# EAGLE design heater-board (EAGLE 5.11)
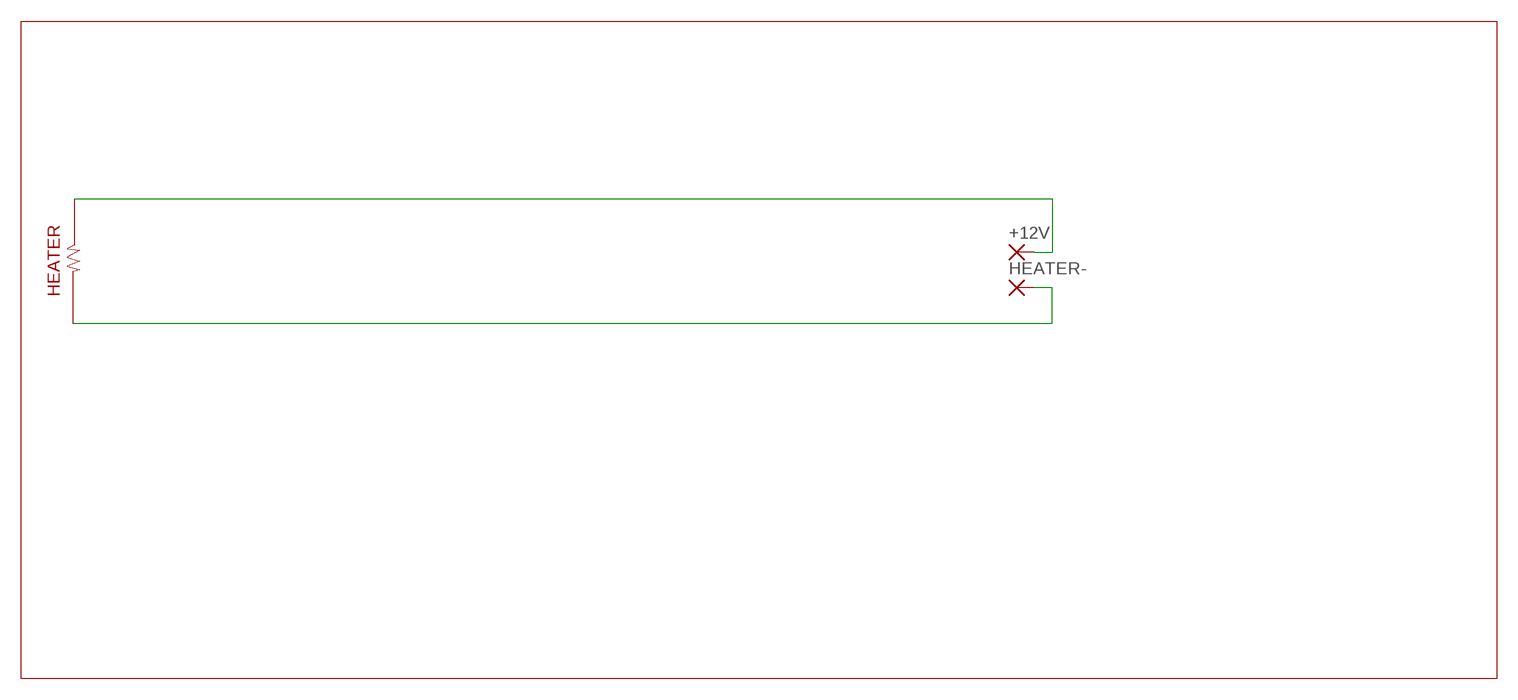
[diagram p0: schematic, sheet 1]

## Parts
+12V  WIREPADSMD5-1,8  [5-1,8]
HEATER-  WIREPADSMD5-1,8  [5-1,8]

## Nets
N$1: HEATER-.1(P)
N$37: +12V.1(P)

## Notes on the sheet
- HEATER

## Library data of the parts
+12V HEATER- = wirepad:WIREPAD: Wire PAD connect wire on PCB

## Board
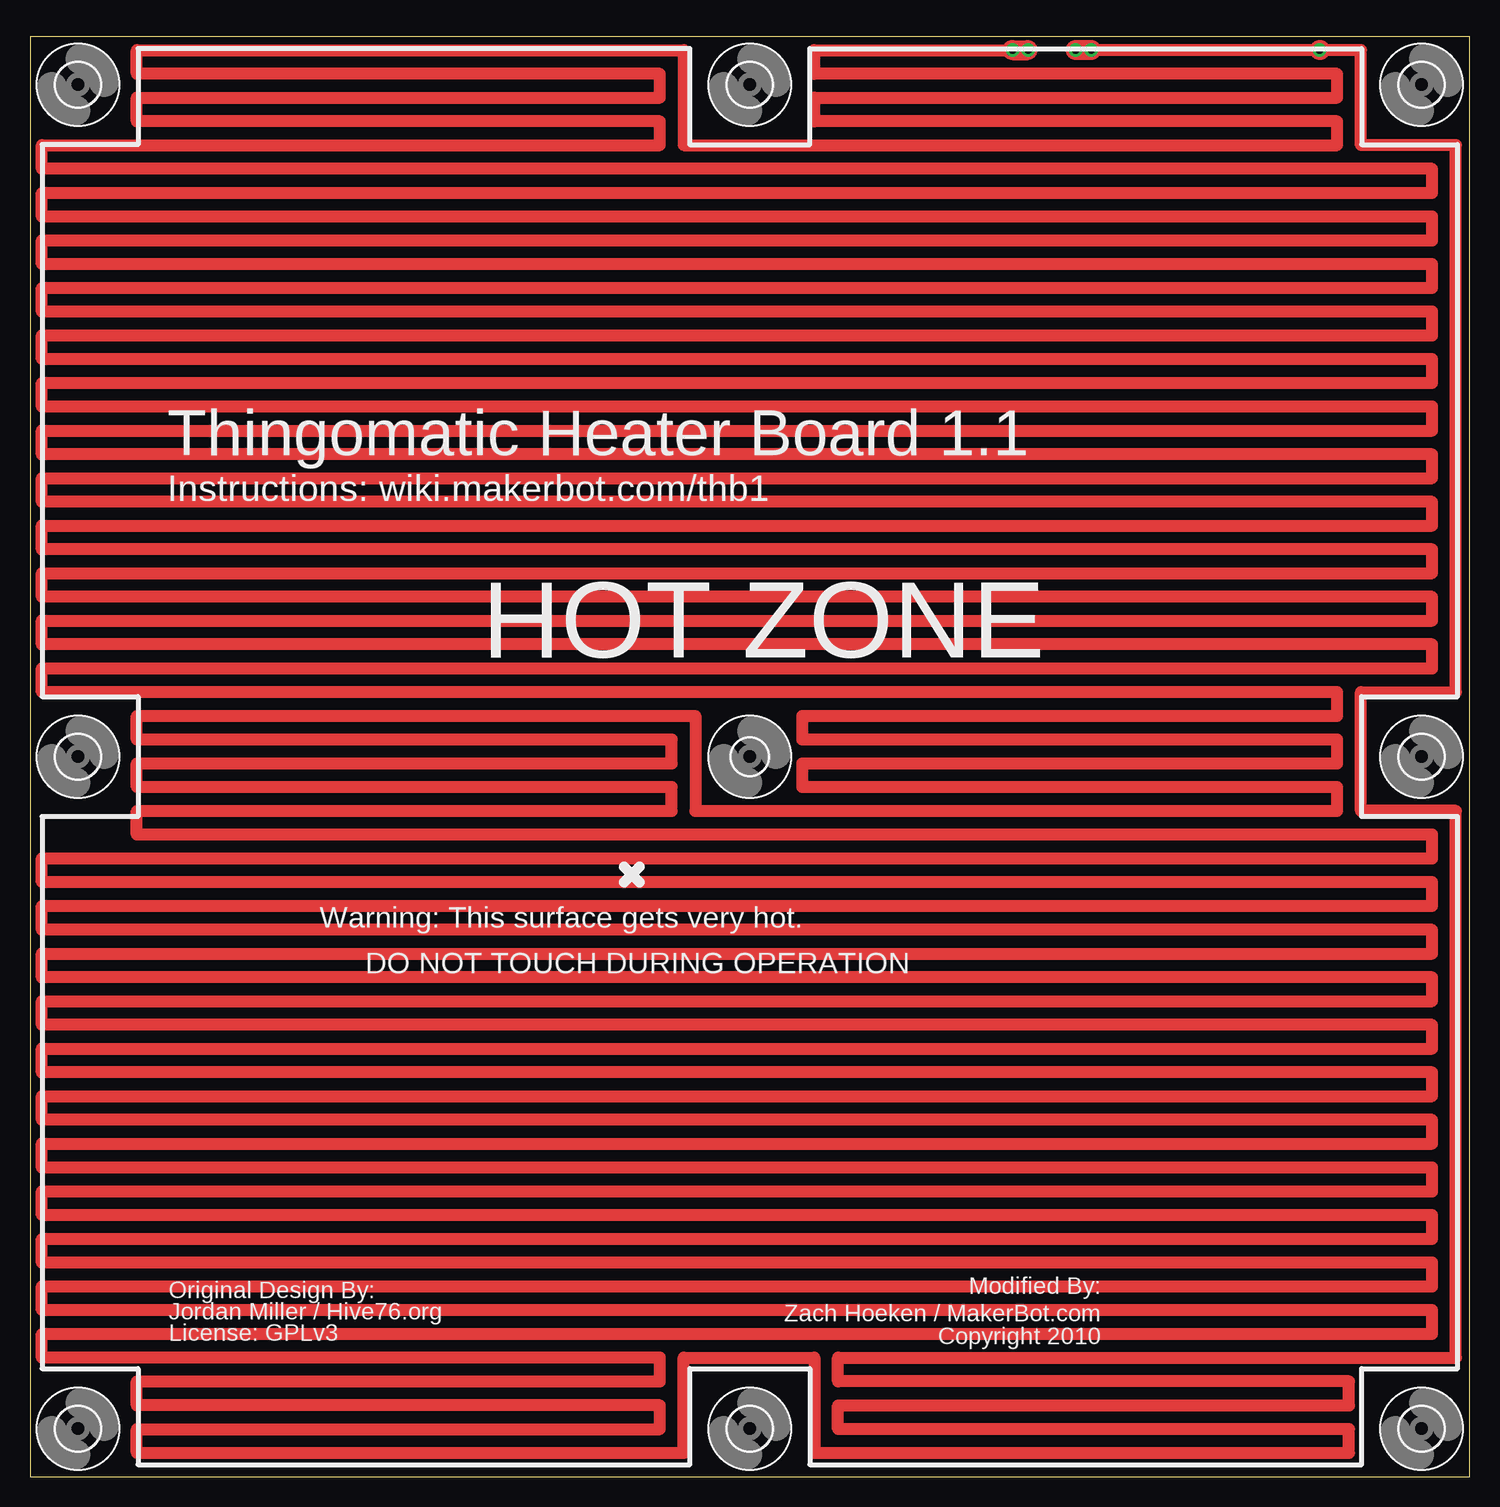
[diagram p1: board, top side]
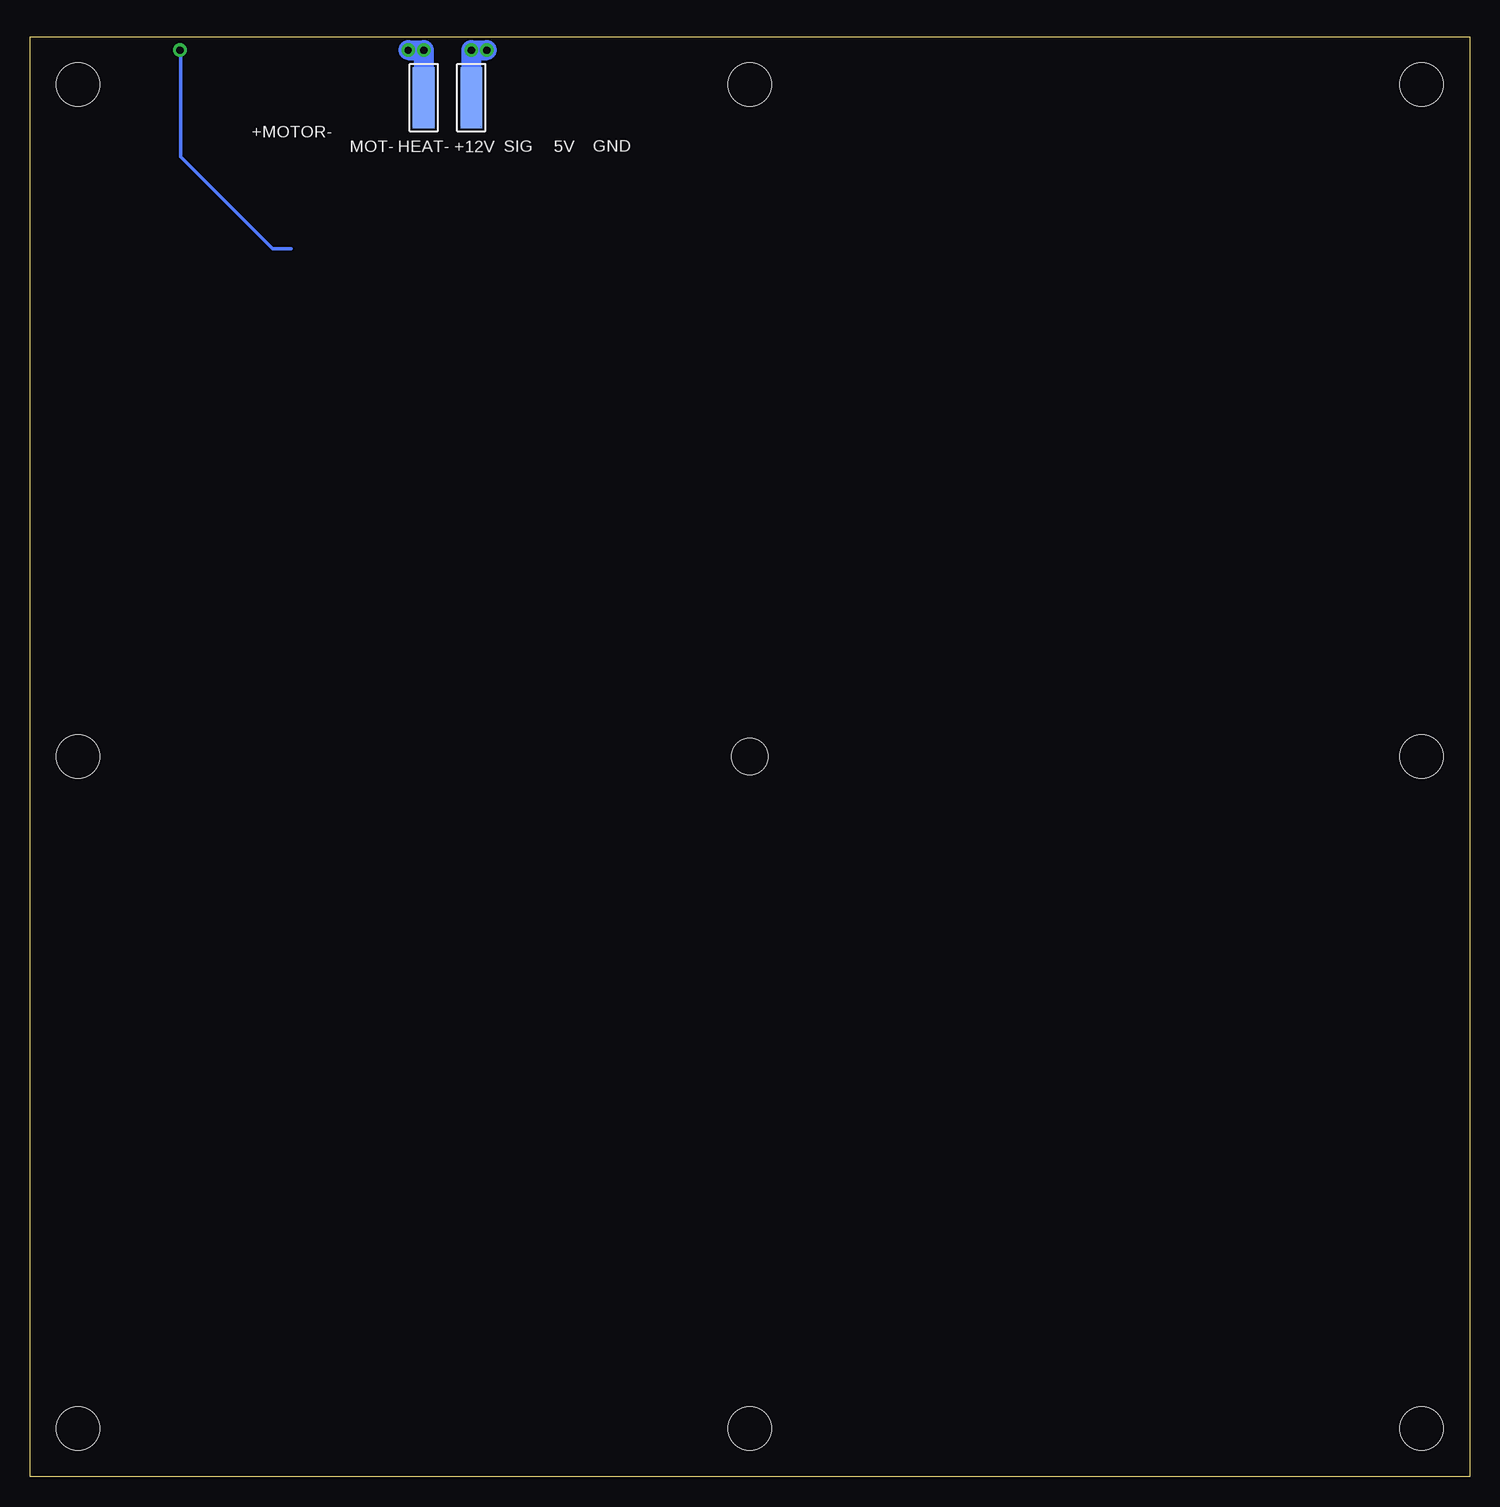
[diagram p2: board, bottom side, seen from below]

Size 120 x 120 mm. Coordinates in mm from the lower left corner, seen from the top.
Outline: 0,0 120,0 120,120 0,120 0,0
Copper layers (1*16): Top 0.035mm / dielectric 1.5mm / Bottom 0.035mm
Design rules "SparkFun *": minimum track width 10mil, minimum drill 20mil, track to track 10mil, track to pad 10mil, pad to pad 10mil, via to via 10mil, smd to smd 10mil, copper to edge 10mil, drill to drill 8mil, minimum pad ring 12mil, minimum via ring 10mil, stop-mask expansion 4mil, vias tented up to drill 25mil, thermal gap 10mil

### Footprints (pad centres in the part's own frame; a part is rotated, then mirrored left to right if it is on the bottom)
5-1,8 = smd 1.829 x 5.08: 1 0,0
3,0 = hole 3: 0,0
3,6 = hole 3.6: 0,0

### Placement (x,y rotation side)
+12V  83.21,114.91 180 bottom
HEATER-  87.17,114.91 180 bottom
U$1  [3,0]  60,60 0 top
U$2  [3,6]  4,4 0 top
U$3  [3,6]  4,60 0 top
U$4  [3,6]  4,116 0 top
U$5  [3,6]  116,116 0 top
U$6  [3,6]  116,60 0 top
U$7  [3,6]  116,4 0 top
U$8  [3,6]  60,4 0 top
U$9  [3,6]  60,116 0 top

### Tracks (layer width: path | path; a pad name or v marks a point on that pad's centre or on a via)
N$1  (via drill 0.6)
  Top 0.991: 107.56,118.87 110.95,118.87 110.95,110.95 118.87,110.95 118.87,65.38 110.95,65.38 110.95,55.47 118.87,55.47 118.87,9.91 67.36,9.91 67.36,7.92 109.96,7.92 109.96,5.94 67.36,5.94 67.36,3.96 109.96,3.96 109.96,1.98 65.38,1.98 65.38,9.91 54.48,9.91 54.48,1.98 8.91,1.98 8.91,3.96 52.5,3.96 52.5,5.94 8.91,5.94 8.91,7.92 52.5,7.92 52.5,9.91 0.99,9.91 0.99,11.89 116.89,11.89 116.89,13.87 0.99,13.87 0.99,15.85 116.89,15.85 116.89,17.83 0.99,17.83 0.99,19.81 116.89,19.81 116.89,21.79 0.99,21.79 0.99,23.77 116.89,23.77 116.89,25.76 0.99,25.76 0.99,27.74 116.89,27.74 116.89,29.72 0.99,29.72 0.99,31.7 116.89,31.7 116.89,33.68 0.99,33.68 0.99,35.66 116.89,35.66 116.89,37.64 0.99,37.64 0.99,39.62 116.89,39.62 116.89,41.6 0.99,41.6 0.99,43.59 116.89,43.59 116.89,45.57 0.99,45.57 0.99,47.55 116.89,47.55 116.89,49.53 0.99,49.53 0.99,51.51 116.89,51.51 116.89,53.49 8.91,53.49 8.91,55.47 53.49,55.47 53.49,57.45 8.91,57.45 8.91,59.44 53.49,59.44 53.49,61.42 8.91,61.42 8.91,63.4 55.47,63.4 55.47,55.47 108.97,55.47 108.97,57.45 64.39,57.45 64.39,59.44 108.97,59.44 108.97,61.42 64.39,61.42 64.39,63.4 108.97,63.4 108.97,65.38 0.99,65.38 0.99,67.36 116.89,67.36 116.89,69.34 0.99,69.34 0.99,71.32 116.89,71.32 116.89,73.3 0.99,73.3 0.99,75.29 116.89,75.29 116.89,77.27 0.99,77.27 0.99,79.25 116.89,79.25 116.89,81.23 0.99,81.23 0.99,83.21 116.89,83.21 116.89,85.19 0.99,85.19 0.99,87.17 116.89,87.17 116.89,89.15 0.99,89.15 0.99,91.14 116.89,91.14 116.89,93.12 0.99,93.12 0.99,95.1 116.89,95.1 116.89,97.08 0.99,97.08 0.99,99.06 116.89,99.06 116.89,101.04 0.99,101.04 0.99,103.02 116.89,103.02 116.89,105 0.99,105 0.99,106.98 116.89,106.98 116.89,108.97 0.99,108.97 0.99,110.95 52.5,110.95 52.5,112.93 8.91,112.93 8.91,114.91 52.5,114.91 52.5,116.89 8.91,116.89 8.91,118.87 54.48,118.87 54.48,110.95 108.97,110.95 108.97,112.93 65.38,112.93 65.38,114.91 108.97,114.91 108.97,116.89 65.38,116.89 65.38,118.87 81.89,118.87
  Top 0.991: v107.49,118.87 v88.47,118.87 | 83.19,118.87 v83.21,118.87
  Top 1.676: v88.47,118.87 v87.17,118.87 | 81.89,118.87 83.19,118.87 | 107.56,118.87 v107.49,118.87
  Bottom 0.305: HEATER-.1 87.22,114.96 | 107.48,118.86 v107.49,118.87 107.44,118.82 107.44,109.98 99.79,102.33 98.23,102.33
  Bottom 0.864: HEATER-.1 87.22,114.91
  Bottom 1.016: HEATER-.1 87.22,114.86
  Bottom 1.676: v88.47,118.87 v87.17,118.87 HEATER-.1 | 83.21,114.91 v83.21,118.87 v81.92,118.87

### Text on the board
tPlace: Thingomatic Heater Board 1.1 | Instructions: wiki.makerbot.com/thb1 | HOT ZONE | Warning: This surface gets very hot. | DO NOT TOUCH DURING OPERATION | Modified By: | Original Design By: | Zach Hoeken / MakerBot.com | Jordan Miller / Hive76.org | Copyright 2010 | License: GPLv3
bPlace: +MOTOR- | GND | 5V | SIG | +12V | HEAT- | MOT-